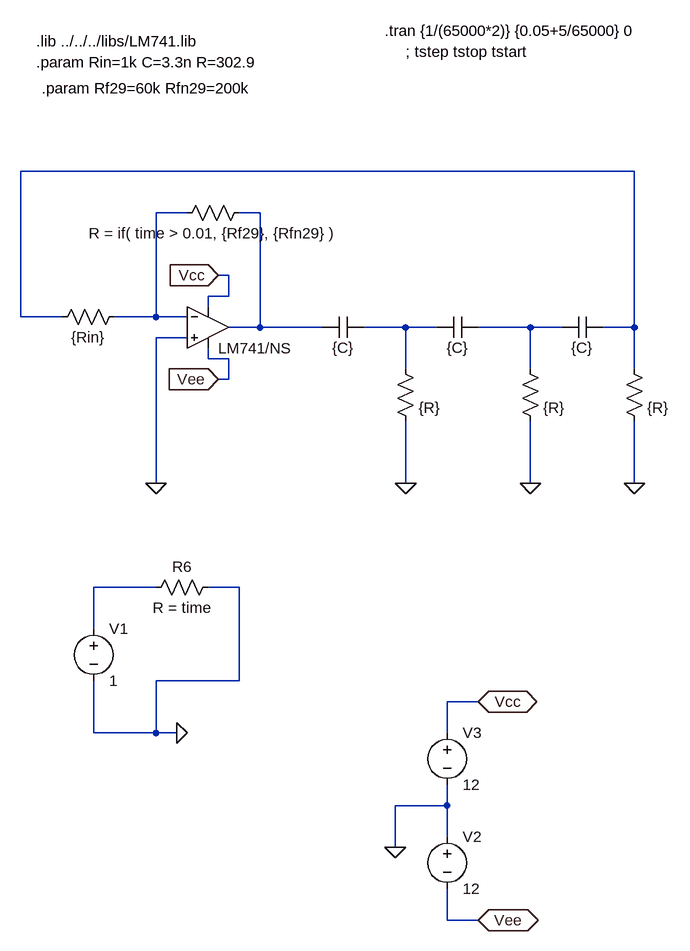
[diagram p0: schematic complete.asc]
complete.asc, the LTspice schematic file:
Version 4
SHEET 1 928 1128
WIRE 816 -96 -128 -96
WIRE 128 -32 80 -32
WIRE 240 -32 208 -32
WIRE 192 64 176 64
WIRE 192 96 192 64
WIRE 192 96 160 96
WIRE 160 112 160 96
WIRE -128 128 -128 -96
WIRE -64 128 -128 128
WIRE 80 128 80 -32
WIRE 80 128 16 128
WIRE 128 128 80 128
WIRE 240 144 240 -32
WIRE 240 144 192 144
WIRE 336 144 240 144
WIRE 464 144 400 144
WIRE 512 144 464 144
WIRE 656 144 576 144
WIRE 704 144 656 144
WIRE 816 144 816 -96
WIRE 816 144 768 144
WIRE 128 160 80 160
WIRE 160 192 160 176
WIRE 192 192 160 192
WIRE 464 208 464 144
WIRE 656 208 656 144
WIRE 816 208 816 144
WIRE 192 224 192 192
WIRE 192 224 176 224
WIRE 80 384 80 160
WIRE 464 384 464 288
WIRE 656 384 656 288
WIRE 816 384 816 288
WIRE 80 544 -16 544
WIRE 208 544 160 544
WIRE -16 608 -16 544
WIRE 208 688 208 544
WIRE 208 688 80 688
WIRE 576 720 528 720
WIRE -16 768 -16 688
WIRE 80 768 80 688
WIRE 80 768 -16 768
WIRE 112 768 80 768
WIRE 528 768 528 720
WIRE 528 880 528 848
WIRE 528 880 448 880
WIRE 528 928 528 880
WIRE 448 944 448 880
WIRE 528 1056 528 1008
WIRE 576 1056 528 1056
FLAG 464 384 0
FLAG 656 384 0
FLAG 176 64 Vcc
IOPIN 176 64 In
FLAG 176 224 Vee
IOPIN 176 224 In
FLAG 80 384 0
FLAG 816 384 0
FLAG 112 768 0
FLAG 448 944 0
FLAG 576 720 Vcc
IOPIN 576 720 BiDir
FLAG 576 1056 Vee
IOPIN 576 1056 BiDir
SYMBOL opamp2 160 80 R0
WINDOW 0 16 32 Invisible 2
SYMATTR InstName U1
SYMATTR Value LM741/NS
SYMBOL res 224 -48 R90
WINDOW 0 0 56 Invisible 2
WINDOW 3 32 56 VTop 2
SYMATTR InstName R1
SYMATTR Value R = if( time > 0.01, {Rf29}, {Rfn29} )
SYMBOL res 32 112 R90
WINDOW 0 0 56 Invisible 2
WINDOW 3 32 56 VTop 2
SYMATTR InstName R2
SYMATTR Value {Rin}
SYMBOL cap 400 128 R90
WINDOW 0 0 32 Invisible 2
WINDOW 3 32 32 VTop 2
SYMATTR InstName C1
SYMATTR Value {C}
SYMBOL cap 576 128 R90
WINDOW 0 0 32 Invisible 2
WINDOW 3 32 32 VTop 2
SYMATTR InstName C2
SYMATTR Value {C}
SYMBOL cap 768 128 R90
WINDOW 0 0 32 Invisible 2
WINDOW 3 32 32 VTop 2
SYMATTR InstName C3
SYMATTR Value {C}
SYMBOL res 448 192 R0
WINDOW 0 36 40 Invisible 2
SYMATTR InstName R3
SYMATTR Value {R}
SYMBOL res 640 192 R0
WINDOW 0 36 40 Invisible 2
SYMATTR InstName R4
SYMATTR Value {R}
SYMBOL res 800 192 R0
WINDOW 0 36 40 Invisible 2
SYMATTR InstName R5
SYMATTR Value {R}
SYMBOL voltage -16 592 R0
SYMATTR InstName V1
SYMATTR Value 1
SYMBOL res 176 528 R90
WINDOW 0 0 56 VBottom 2
WINDOW 3 32 56 VTop 2
SYMATTR InstName R6
SYMATTR Value R = time
SYMBOL voltage 528 912 R0
SYMATTR InstName V2
SYMATTR Value 12
SYMBOL voltage 528 752 R0
SYMATTR InstName V3
SYMATTR Value 12
TEXT -104 -296 Left 2 !.lib ../../../libs/LM741.lib
TEXT -104 -264 Left 2 !.param Rin=1k C=3.3n R=302.9
TEXT 432 -312 Left 2 !.tran {1/(65000*2)} {0.05+5/65000} 0
TEXT 464 -280 Left 2 !; tstep tstop tstart
TEXT -96 -224 Left 2 !.param Rf29=60k Rfn29=200k

The netlist it stands for:
* complete.asc
XU1 0 N002 Vcc Vee N003 LM741/NS  ; pins In+ In- V+ V- OUT
R1 N003 N002 R = if( time > 0.01, {Rf29}, {Rfn29} )
R2 N002 N001 {Rin}
C1 N004 N003 {C}
C2 N005 N004 {C}
C3 N001 N005 {C}
R3 N004 0 {R}
R4 N005 0 {R}
R5 N001 0 {R}
V1 N006 0 1
R6 0 N006 R = time
V2 0 Vee 12
V3 Vcc 0 12
.lib ../../../libs/LM741.lib
.param Rin=1k C=3.3n R=302.9
.tran {1/(65000*2)} {0.05+5/65000} 0
; tstep tstop tstart
.param Rf29=60k Rfn29=200k
.backanno
.end